# EasyEDA Pro project ProPrj_FLAVRTOWN BADGE_2026-02-28.epro, schematic Schematic1
Board Name: Board1; Create Date: 2026-02-21; Page Name: P1; Project Name: FLAVRTOWN BADGE; Schematic Name: Schematic1; Update Date: 2026-02-23; Company: EasyEDA.com; Page Size: A4; Version: V1.0
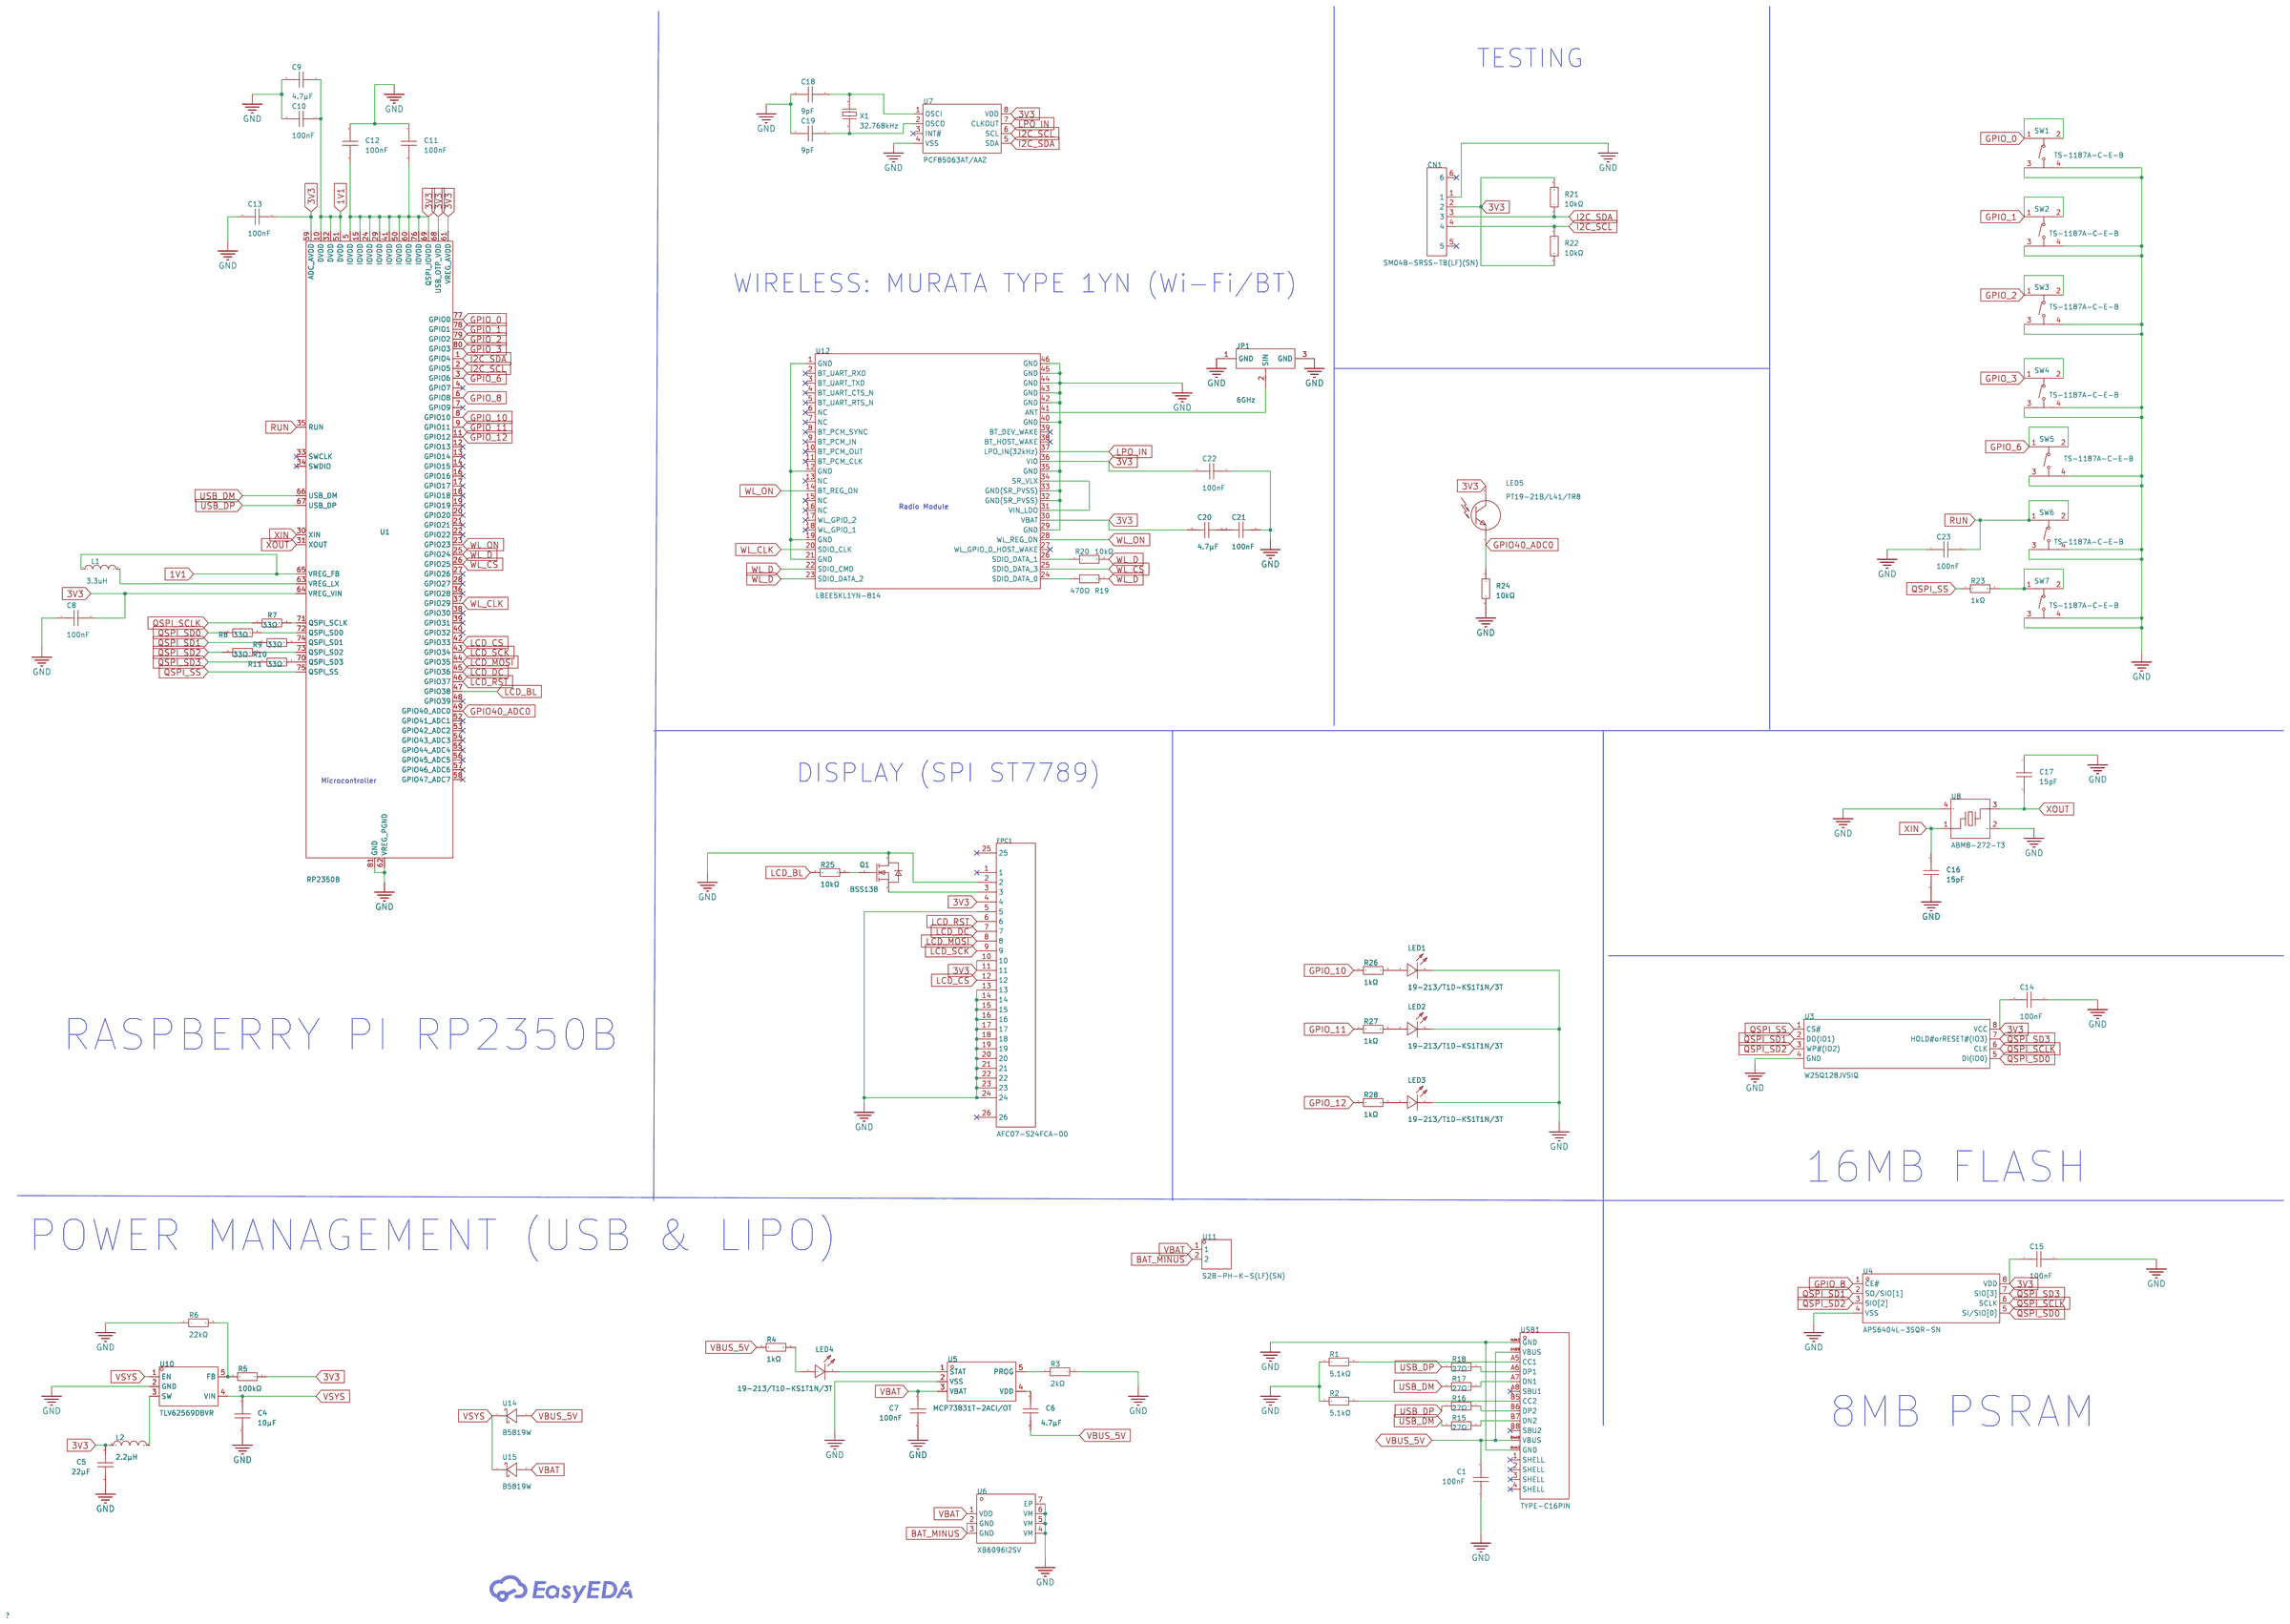
[diagram p0: schematic sheet]

## Parts
C1  100nF  [C0805]
C4  10μF  [C0201]
C5  22μF  [C0201]
C6  4.7μF  [C0201]
C7  100nF  [C0201]
C8  100nF  [C0201]
C9  4.7μF  [C0201]
C10  100nF  [C0201]
C11  100nF  [C0201]
C12  100nF  [C0201]
C13  100nF  [C0201]
C14  100nF  [C0201]
C15  100nF  [C0201]
C16  15pF  [C0201]
C17  15pF  [C0201]
C18  9pF  [C0201]
C19  9pF  [C0201]
C20  4.7μF  [C0201]
C21  100nF  [C0201]
C22  100nF  [C0201]
C23  100nF  [C0201]
CN1  SM04B-SRSS-TB(LF)(SN)  [CONN-SMD_4P-P1.00_SM04B-SRSS-TB-LF-SN]
FPC1  AFC07-S24FCA-00  [FPC-SMD_AFC07-S24FCA-00]
JP1  6GHz  [ANT-SMD_UFL-R-SMT-1-10]
L1  3.3uH  [IND-SMD_L2.0-W1.6_AOTA-B201610S3R3-101-T]
L2  2.2μH  [L0402]
LED1  19-213/T1D-KS1T1N/3T  [LED0603-R-RD]
LED2  19-213/T1D-KS1T1N/3T  [LED0603-R-RD]
LED3  19-213/T1D-KS1T1N/3T  [LED0603-R-RD]
LED4  19-213/T1D-KS1T1N/3T  [LED0603-R-RD]
LED5  PT19-21B/L41/TR8  [SENSOR-TH_PT19-21B-L41-TR8]
Q1  BSS138  [SOT-23-3_L3.0-W1.7-P0.95-LS2.9-BR]
R1  5.1kΩ  [R0603]
R2  5.1kΩ  [R0603]
R3  2kΩ  [R0603]
R4  1kΩ  [R0603]
R5  100kΩ  [R0603]
R6  22kΩ  [R0603]
R7  33Ω  [R0603]
R8  33Ω  [R0603]
R9  33Ω  [R0603]
R10  33Ω  [R0603]
R11  33Ω  [R0603]
R15  27Ω  [R0603]
R16  27Ω  [R0603]
R17  27Ω  [R0603]
R18  27Ω  [R0603]
R19  470Ω  [R0603]
R20  10kΩ  [R0603]
R21  10kΩ  [R0603]
R22  10kΩ  [R0603]
R23  1kΩ  [R0603]
R24  10kΩ  [R0603]
R25  10kΩ  [R0603]
R26  1kΩ  [R0603]
R27  1kΩ  [R0603]
R28  1kΩ  [R0603]
SW1  TS-1187A-C-E-B  [SW-SMD_4P-L5.1-W5.1-P3.70-LS6.5-TL_H2.5]
SW2  TS-1187A-C-E-B  [SW-SMD_4P-L5.1-W5.1-P3.70-LS6.5-TL_H2.5]
SW3  TS-1187A-C-E-B  [SW-SMD_4P-L5.1-W5.1-P3.70-LS6.5-TL_H2.5]
SW4  TS-1187A-C-E-B  [SW-SMD_4P-L5.1-W5.1-P3.70-LS6.5-TL_H2.5]
SW5  TS-1187A-C-E-B  [SW-SMD_4P-L5.1-W5.1-P3.70-LS6.5-TL_H2.5]
SW6  TS-1187A-C-E-B  [SW-SMD_4P-L5.1-W5.1-P3.70-LS6.5-TL_H2.5]
SW7  TS-1187A-C-E-B  [SW-SMD_4P-L5.1-W5.1-P3.70-LS6.5-TL_H2.5]
U1  RP2350B  [QFN-80_L10.0-W10.0-P0.40-TL-EP3.4]
U3  W25Q128JVSIQ  [SOIC-8_L5.3-W5.3-P1.27-LS8.0-BL]
U4  APS6404L-3SQR-SN  [SOIC-8_L4.9-W3.9-P1.27-LS6.0-BL]
U5  MCP73831T-2ACI/OT  [SOT-23-5_L3.0-W1.7-P0.95-LS2.8-BL]
U6  XB6096I2SV  [WDFN-6_L2.0-W2.0-P0.65-BL-EP]
U7  PCF85063AT/AAZ  [SO-8_L4.9-W3.9-P1.27-LS5.9-BL]
U8  ABM8-272-T3  [CRYSTAL-SMD_4P-L3.2-W2.5-BL]
U10  TLV62569DBVR  [SOT-23-5_L3.0-W1.7-P0.95-LS2.8-BR]
U11  S2B-PH-K-S(LF)(SN)  [CONN-TH_S2B-PH-K-S-LF-SN]
U12  LBEE5KL1YN-814  [LGA-46_L7.0-W5.2_LBEE5KL1DX-883]
U14  B5819W  [SOD-123_L2.7-W1.8-LS3.7-RD]
U15  B5819W  [SOD-123_L2.7-W1.8-LS3.7-RD]
USB1  TYPE-C16PIN  [USB-C-SMD_TYPE-C16PIN]
X1  32.768kHz  [CRYSTAL-SMD_L3.2-W1.5-1]

## Library data of the parts
C1 = CAP_0805: Supplier Footprint: 0805
C4-C23 = CAP_0201: Supplier Footprint: 0201
CN1 = SM04B-SRSS-TB(LF)(SN): Pins Structure:1x4P Pitch:1mm Mounting Type:Surface Mount, Right Angle Reference Series:SH Number of Pins:4P Number of Rows:1 Number of PINs Per Row:4 Row Spacing:- Current Rating:1A Contact Material:Copper Alloy Contact Plating:Tin Operating Temperature:; LCSC Part Name: 1x4P 间距:1mm 卧贴 系列:SH; Supplier Part: C160404; Manufacturer: JST; Supplier Footprint: SMD,P=1mm,卧贴; JLCPCB Part Class: Extended Part; Datasheet: https://item.szlcsc.com/datasheet/SM04B-SRSS-TB(LF)(SN)/171784.html; Supplier: LCSC; Pins Structure: 1x4P; Pitch: 1mm; Mounting Type: Surface Mount, Right Angle; Reference Series: SH; Number of Pins: 4P; Number of Rows: 1; Number of PINs Per Row: 4; Current Rating: 1A; Contact Material: Copper Alloy; Contact Plating: Tin; Operating Temperature: -25℃~+85℃; Voltage Rating: 50V; Plastic Material: PA; Flame Retardant Rating: UL94V-0; Supplementary Features: Auxiliary Solder Pin; Color: White; Z-Height of the Board: 2.9mm; X-Length of Bottom Edge on Board (Spacing Line): 6mm; Y-Width of Bottom Edge on Board: 4.32mm
FPC1 = AFC07-S24FCA-00: Locking Feature:Slide Lock Contact Type:Bottom Contact Number of Contacts:24P Pitch:0.5mm Mounting Type:Surface Mount, Right Angle FFC, FCB Thickness:0.3mm FFC, FCB Thickness:0.3mm Height Above Board:2mm Contact Material:Copper Alloy Contact Plating:Tin; LCSC Part Name: 抽屉式 下接 P数:24P 间距:0.5mm; Supplier Part: C262567; Manufacturer: JS(钜硕电子); Supplier Footprint: SMD,P=0.5mm,卧贴; JLCPCB Part Class: Extended Part; Datasheet: https://item.szlcsc.com/datasheet/AFC07-S24FCA-00/253876.html; Supplier: LCSC; Locking Feature: Slide Lock; Contact Type: Bottom Contact; Number of Contacts: 24P; Pitch: 0.5mm; Mounting Type: Surface Mount, Right Angle; FFC, FCB Thickness: 0.3mm; Height Above Board: 2mm; Contact Material: Copper Alloy; Contact Plating: Tin
JP1 = U.FL-R-SMT-1(10): Connector Type:Board Side Interface:Male Pin Number of Ports:1 Interface Diameter:2mm Interface Length/Height:1.25mm Frequency:6GHz RF Series:IPEX Impedance:50Ω Style:- Operating Temperature Range:-40℃~+90℃ Operating Temperature Range:-40℃~+90℃; LCSC Part Name: IPEX 内针; Supplier Part: C88373; Manufacturer: HRS(广濑); Supplier Footprint: SMD; JLCPCB Part Class: Extended Part; Datasheet: https://item.szlcsc.com/datasheet/U.FL-R-SMT-1(10)/89552.html; Supplier: LCSC; Connector Type: Board Side; Interface: Male Pin; Number of Ports: 1; Interface Diameter: 2mm; Interface Length/Height: 1.25mm; RF Series: IPEX; Impedance: 50Ω; Operating Temperature Range: -40℃~+90℃
L1 = AOTA-B201610S3R3-101-T: Inductance:3.3uH Current Rating:2.1A Current - Saturation(Isat):2.4A DC Resistance(DCR):115mΩ Type:Molded Inductor; LCSC Part Name: 3.3uH 2.4A; Supplier Part: C42411119; Manufacturer: ABRACON; Supplier Footprint: 0806; JLCPCB Part Class: Extended Part; Datasheet: https://item.szlcsc.com/datasheet/AOTA-B201610S3R3-101-T/44392932.html; Supplier: LCSC; Current Rating: 2.1A; Current - Saturation(Isat): 2.4A; DC Resistance(DCR): 115mΩ; Type: Molded Inductor
L2 = L_0402
LED1-LED4 = 19-213/T1D-KS1T1N/3T: Illumination Color:White; LCSC Part Name: 停产 白灯; Supplier Part: C183845; Manufacturer: EVERLIGHT(亿光); Supplier Footprint: 0603; JLCPCB Part Class: Extended Part; Datasheet: https://en.everlight.com/wp-content/plugins/ItemRelationship/product_files/pdf/19-213-T1D-KS1T1N-3T.pdf; Supplier: LCSC; Illumination Color: White
LED5 = PT19-21B/L41/TR8: type:NPN Collector - Emitter Voltage VCEO:30V Collector - Emitter Voltage VCEO:30V Current - Collector(Ic):20mA Dissipation Power(Max):75mW Current - Dark(Id):100nA Peak Wavelength:940nm Viewing Angle:- Operating Temperature:-25℃~+85℃ Operating Temperatur; LCSC Part Name: 940nm的NPN光电三极管; Supplier Part: C131258; Manufacturer: EVERLIGHT(亿光); Supplier Footprint: 0603; JLCPCB Part Class: Extended Part; Datasheet: https://www.everlight.com.cn/wp-content/plugins/ItemRelationship/product_files/pdf/DPT-0000302-PT19-21B-L41-TR8_Datasheet_Rev6.pdf; Supplier: LCSC; type: NPN; Collector - Emitter Voltage VCEO: 30V; Current - Collector(Ic): 20mA; Dissipation Power(Max): 75mW; Current - Dark(Id): 100nA; Peak Wavelength: 940nm; Operating Temperature: -25℃~+85℃; Vce Saturation(VCE(sat)): 0.4V@2mA
Q1 = BSS138_C53058666: Supplier Part: C53058666; Manufacturer: luJing(鲁晶); Supplier Footprint: SOT-23; JLCPCB Part Class: Extended Part; Datasheet: https://item.szlcsc.com/datasheet/BSS138/56008455.html; Supplier: LCSC
R1-R11 R15-R28 = Res_0603: Supplier Footprint: 0603
SW1-SW7 = TS-1187A-C-E-B: Circuit:SPST Actuator Style:Round Button Operating Force:2.6N Mounting Type:Surface Mount,Vertical Length:5.1mm Width:5.1mm Switch Height:2.5mm with Bracket:Without Bracket Contact Current:50mA Voltage Rating:12V Actuator/Cap Color:Gold With Lamp:No IP Ra; LCSC Part Name: 5.1*5.1*2.5mm 立贴 轻触开关; Supplier Part: C318887; Manufacturer: XKB Connection(中国星坤); Supplier Footprint: SMD; JLCPCB Part Class: Extended Part; Datasheet: https://item.szlcsc.com/datasheet/TS-1187A-C-E-B/299979.html; Supplier: LCSC; Circuit: SPST; Actuator Style: Round Button; Operating Force: 2.6N; Mounting Type: Surface Mount,Vertical; Length: 5.1mm; Width: 5.1mm; Switch Height: 2.5mm; with Bracket: Without Bracket; Contact Current: 50mA; Voltage Rating: 12V; Actuator/Cap Color: Gold; With Lamp: No; Life: 100,000 Cycles; Operating Temperature: -30℃~+85℃
U1 = RP2350B_C42415655: LCSC Part Name: 微控制器; Supplier Part: C42415655; Manufacturer: Raspberry Pi(树莓派); Supplier Footprint: QFN-80-EP(10x10); JLCPCB Part Class: Extended Part; Datasheet: https://item.szlcsc.com/datasheet/RP2350B/44413055.html; Supplier: LCSC
U3 = W25Q128JVSIQ_C113767: Interface:SPI Memory Size:- Clock Frequency:133MHz Voltage - Supply:2.7V~3.6V Voltage - Supply:2.7V~3.6V Program / Erase Cycles:100,000 Cycles Page Programming Time (Tpp):3ms Operating Temperature:- Operating Temperature:-; LCSC Part Name: 支持双路/四路SPI接口的3V、128Mbit 串行闪存; Supplier Part: C113767; Manufacturer: Winbond(华邦); Supplier Footprint: SOIC-8-208mil; JLCPCB Part Class: Extended Part; Datasheet: https://item.szlcsc.com/datasheet/W25Q128JVSIQ/115003.html; Supplier: LCSC; Interface: SPI; Clock Frequency: 133MHz; Voltage - Supply: 2.7V~3.6V; Program / Erase Cycles: 100,000 Cycles; Page Programming Time (Tpp): 3ms
U4 = APS6404L-3SQR-SN_C5333729: Supplier Part: C5333729; Manufacturer: Apmemory; Supplier Footprint: SOP-8; JLCPCB Part Class: Extended Part; Supplier: LCSC
U5 = MCP73831T-2ACI/OT: The Chip Type:Charging IC Voltage - Supply:3.75V~6V Voltage - Supply:3.75V~6V Charge Current - Max:550mA Charging Saturation Voltage:4.2V Type of Battery:Lithium Battery Number of Cells:1 Number of Cells:1 Operating Temperature:-40℃~+85℃ Operating Tempera; LCSC Part Name: 单节锂离子/锂聚合物充电管理控制器; Supplier Part: C424093; Manufacturer: MICROCHIP(美国微芯); Supplier Footprint: SOT-23-5; JLCPCB Part Class: Extended Part; Datasheet: https://item.szlcsc.com/datasheet/MCP73831T-2ACI%252FOT/417116.html; Supplier: LCSC; The Chip Type: Charging IC; Voltage - Supply: 3.75V~6V; Charge Current - Max: 550mA; Charging Saturation Voltage: 4.2V; Type of Battery: Lithium Battery; Number of Cells: 1; Operating Temperature: -40℃~+85℃; Supply Current (Iq): 53uA
U6 = XB6096I2SV: The Chip Type:- Voltage - Supply:3.6V~6V Voltage - Supply:3.6V~6V Charging Saturation Voltage:4.3V End-Off Voltage:2.8V Type of Battery:Lithium Battery Number of Cells:1 Number of Cells:1 Operating Temperature:-40℃~+85℃ Operating Temperature:-40℃~+85℃ 0V; LCSC Part Name: 停产 One Cell Lithium-ion/Polymer Battery Protection IC 停产; Supplier Part: C2998744; Manufacturer: xysemi(赛芯微); Supplier Footprint: DFN-6(2x2); JLCPCB Part Class: Extended Part; Datasheet: https://item.szlcsc.com/datasheet/XB6096I2SV/3473618.html; Supplier: LCSC; Voltage - Supply: 3.6V~6V; Charging Saturation Voltage: 4.3V; End-Off Voltage: 2.8V; Type of Battery: Lithium Battery; Number of Cells: 1; Operating Temperature: -40℃~+85℃; 0V Battery Charge: Support; Supply Current (Iq): 100nA
U7 = PCF85063AT/AAZ: Interface:I2C Voltage - Supply:900mV~5.5V Voltage - Supply:900mV~5.5V Current - Supply:220nA crystal oscillator:Built-In Alarm Output:Yes Operating Temperature:-40℃~+85℃ Operating Temperature:-40℃~+85℃; LCSC Part Name: 微型实时时钟/日历，带报警功能和I²C总线; Supplier Part: C2157792; Manufacturer: NXP(恩智浦); Supplier Footprint: SO-8; JLCPCB Part Class: Extended Part; Datasheet: https://www.nxp.com.cn/docs/en/data-sheet/PCF85063A.pdf; Supplier: LCSC; Interface: I2C; Voltage - Supply: 900mV~5.5V; Current - Supply: 220nA; crystal oscillator: Built-In; Alarm Output: Yes; Operating Temperature: -40℃~+85℃
U8 = ABM8-272-T3_C20625731: Supplier Part: C20625731; Manufacturer: ABRACON; Supplier Footprint: SMD3225-4P; JLCPCB Part Class: Extended Part; Datasheet: https://item.szlcsc.com/datasheet/ABM8-272-T3/22032038.html; Supplier: LCSC
U10 = TLV62569DBVR: Function:Buck Voltage - Supply:2.5V~5.5V Voltage - Supply:2.5V~5.5V Output Voltage:600mV~5.5V Output Voltage:600mV~5.5V Output Current:2A Frequency - Switching:1.5MHz Frequency - Switching:1.5MHz Operating Temperature:-40℃~+125℃@(TJ) Operating Temperature; LCSC Part Name: 高效率同步降压转换器; Supplier Part: C141836; Manufacturer: TI(德州仪器); Supplier Footprint: SOT-23-5; JLCPCB Part Class: Extended Part; Datasheet: https://www.ti.com/cn/lit/gpn/tlv62569; Supplier: LCSC; Function: Buck; Voltage - Supply: 2.5V~5.5V; Output Voltage: 600mV~5.5V; Output Current: 2A; Frequency - Switching: 1.5MHz; Operating Temperature: -40℃~+125℃@(TJ); Synchronous Rectifier: Yes; Number of Outputs: 1; Topology: Buck; Switch tube (built-in/external): Built-in; Output Type: Adjustable
U11 = S2B-PH-K-S(LF)(SN): Pins Structure:1x2P Pitch:2mm Mounting Type:Right Angle Reference Series:PH Number of Pins:2P Number of Rows:1 Number of PINs Per Row:2 Row Spacing:- Current Rating:2A Contact Material:Brass Contact Plating:Tin Operating Temperature:-25℃~+85℃ Operating Te; LCSC Part Name: 1x2P 间距:2mm 弯插 系列:PH; Supplier Part: C173752; Manufacturer: JST; Supplier Footprint: 弯插,P=2mm; JLCPCB Part Class: Extended Part; Datasheet: https://item.szlcsc.com/datasheet/S2B-PH-K-S(LF)(SN)/185142.html; Supplier: LCSC; Pins Structure: 1x2P; Pitch: 2mm; Mounting Type: Right Angle; Reference Series: PH; Number of Pins: 2P; Number of Rows: 1; Number of PINs Per Row: 2; Current Rating: 2A; Contact Material: Brass; Contact Plating: Tin; Operating Temperature: -25℃~+85℃; Voltage Rating: 100V; Plastic Material: PA66; Flame Retardant Rating: UL94V-0; Supplementary Features: K Pin; Color: White; Z-Height of the Board: 4.8mm; X-Length of Bottom Edge on Board (Spacing Line): 5.9mm; Y-Width of Bottom Edge on Board: 7.6mm
U12 = LBEE5KL1YN-814: Supplier Part: C6583742; Manufacturer: muRata(村田); Supplier Footprint: SMD-46P; JLCPCB Part Class: Extended Part; Datasheet: https://item.szlcsc.com/datasheet/LBEE5KL1YN-814/7538542.html; Supplier: LCSC
U14 U15 = B5819W_C2843323: Diode Configuration:Independent Voltage - Forward(Vf@If):900mV@3A Voltage - DC Reverse(Vr):40V Current - Rectified:1A Reverse Leakage Current (Ir):1mA@40V Operating Junction Temperature Range:-55℃~+125℃ Operating Junction Temperature Range:-55℃~+125℃ Non-; LCSC Part Name: 电压:40V 电流:1A; Supplier Part: C2843323; Manufacturer: Slkor(萨科微); Supplier Footprint: SOD-123; JLCPCB Part Class: Extended Part; Datasheet: https://item.szlcsc.com/datasheet/B5819W/3030279.html; Supplier: LCSC; Diode Configuration: Independent; Voltage - Forward(Vf@If): 900mV@3A; Voltage - DC Reverse(Vr): 40V; Current - Rectified: 1A; Reverse Leakage Current (Ir): 1mA@40V; Operating Junction Temperature Range: -55℃~+125℃; Non-Repetitive Peak Forward Surge Current: 25A
USB1 = TYPE-C16PIN: Connector Type:Type-C Protocol Standard:- Gender:Female Mounting Type:Surface Mount, Right Angle Number of Contacts:16P Number of Ports:1 Current Rating-Power:3A Voltage Rating:30V Connect-Disconnect Life:10,000 Cycles Supplementary Features:- Center Heig; LCSC Part Name: 16P卧贴母座; Supplier Part: C393939; Manufacturer: SHOU HAN(首韩); Supplier Footprint: SMD; JLCPCB Part Class: Extended Part; Datasheet: https://item.szlcsc.com/datasheet/TYPE-C16PIN/372551.html; Supplier: LCSC; Connector Type: Type-C; Gender: Female; Mounting Type: Surface Mount, Right Angle; Number of Contacts: 16P; Number of Ports: 1; Current Rating-Power: 3A; Voltage Rating: 30V; Connect-Disconnect Life: 10,000 Cycles; Detection color: Black; Operating Temperature: -40℃~+85℃
X1 = FC-135R 32.7680KA-A3: Frequency:32.768kHz Normal temperature Frequency Tolerance:±20ppm Normal temperature Frequency Tolerance:±20ppm Load Capacitance:12.5pF Equivalent Series Resistance(ESR):50kΩ Operating Temperature:-40℃~+85℃ Operating Temperature:-40℃~+85℃; LCSC Part Name: 32.768kHz ±20ppm 12.5pF; Supplier Part: C6554955; Manufacturer: EPSON(爱普生); Supplier Footprint: SMD3215-2P; JLCPCB Part Class: Extended Part; Datasheet: https://item.szlcsc.com/datasheet/FC-135R%252032.7680KA-A3/7508731.html; Supplier: LCSC; Normal temperature Frequency Tolerance: ±20ppm; Load Capacitance: 12.5pF; Equivalent Series Resistance(ESR): 50kΩ; Operating Temperature: -40℃~+85℃

## Nets
1V1: C9.1 C10.1 L1.1 U1.10(DVDD) U1.32(DVDD) U1.51(DVDD) U1.65(VREG_FB)
3V3: C5.2 C8.2 C11.2 C12.2 C13.1 C14.2 C15.2 C20.2 C22.2 CN1.2 FPC1.4 FPC1.10 FPC1.11 L2.1 LED5.2(C) R5.2 R21.2 R22.2 U1.5(IOVDD) U1.15(IOVDD) U1.24(IOVDD) U1.29(IOVDD) U1.41(IOVDD) U1.50(IOVDD) U1.59(ADC_AVDD) U1.60(IOVDD) U1.61(VREG_AVDD) U1.64(VREG_VIN) U1.68(USB_OTP_VDD) U1.69(QSPI_IOVDD) U1.76(IOVDD) U3.8(VCC) U4.8(VDD) U7.8(VDD) U12.30(VBAT) U12.36(VIO)
GND: C1.1 C4.2 C5.1 C7.2 C8.1 C9.2 C10.2 C11.1 C12.1 C13.2 C14.1 C15.1 C16.2 C17.1 C18.2 C19.2 C21.1 C22.1 C23.2 CN1.1 FPC1.2 FPC1.5 FPC1.13 FPC1.14 FPC1.15 FPC1.16 FPC1.17 FPC1.18 FPC1.19 FPC1.20 FPC1.21 FPC1.22 FPC1.23 FPC1.24 JP1.1(GND) JP1.3(GND) LED1.2(C) LED2.2(C) LED3.2(C) Q1.3(D) R1.1 R2.1 R3.2 R6.1 R24.2 SW1.3(C) SW1.4(D) SW2.3(C) SW2.4(D) SW3.3(C) SW3.4(D) SW4.3(C) SW4.4(D) SW5.3(C) SW5.4(D) SW6.3(C) SW6.4(D) SW7.3(C) SW7.4(D) U1.62(VREG_PGND) U1.81(GND) U3.4(GND) U4.4(VSS) U5.2(VSS) U6.4(VM) U6.5(VM) U6.6(VM) U6.7(EP) U7.4(VSS) U8.2(GND) U8.4(GND) U10.2(GND) U12.29(GND) U12.32(GND(SR_PVSS)) U12.33(GND(SR_PVSS)) U12.35(GND) U12.40(GND) U12.42(GND) U12.43(GND) U12.44(GND) U12.45(GND) U12.46(GND) USB1.A1B12(GND) USB1.B1A12(GND)
VBAT: C7.1 U5.3(VBAT) U6.1(VDD) U11.1 U15.2(A)
VBUS_5V: C1.2 C6.2 R4.1 U14.2(A) USB1.A4B9(VBUS) USB1.B4A9(VBUS)
BAT_MINUS: U6.2(GND) U6.3(GND) U11.2
GPIO40_ADC0: LED5.1(E) R24.1 U1.49(GPIO40_ADC0)
GPIO_0: SW1.1(A) SW1.2(B) U1.77(GPIO0)
GPIO_1: SW2.1(A) SW2.2(B) U1.78(GPIO1)
GPIO_2: SW3.1(A) SW3.2(B) U1.79(GPIO2)
GPIO_3: SW4.1(A) SW4.2(B) U1.80(GPIO3)
GPIO_6: SW5.1(A) SW5.2(B) U1.3(GPIO6)
GPIO_8: U1.6(GPIO8) U4.1(CE#)
GPIO_10: R26.1 U1.8(GPIO10)
GPIO_11: R27.1 U1.9(GPIO11)
GPIO_12: R28.1 U1.11(GPIO12)
I2C_SCL: CN1.4 R22.1 U1.2(GPIO5) U7.6(SCL)
I2C_SDA: CN1.3 R21.1 U1.1(GPIO4) U7.5(SDA)
LCD_BL: Q1.1(G) R25.1 R25.2 U1.47(GPIO38)
LCD_CS: FPC1.12 U1.42(GPIO33)
LCD_DC: FPC1.7 U1.45(GPIO36)
LCD_MOSI: FPC1.8 U1.44(GPIO35)
LCD_RST: FPC1.6 U1.46(GPIO37)
LCD_SCK: FPC1.9 U1.43(GPIO34)
LPO_IN: U7.7(CLKOUT) U12.37(LPO_IN(32kHz))
QSPI_SCLK: R7.1 U3.6(CLK) U4.6(SCLK)
QSPI_SD0: R8.1 U3.5(DI(IO0)) U4.5(SI/SIO[0])
QSPI_SD1: R9.1 U3.2(DO(IO1)) U4.2(SO/SIO[1])
QSPI_SD2: R10.1 U3.3(WP#(IO2)) U4.3(SIO[2])
QSPI_SD3: R11.1 U3.7(HOLD#orRESET#(IO3)) U4.7(SIO[3])
QSPI_SS: R23.1 U1.75(QSPI_SS) U3.1(CS#)
RUN: C23.1 SW6.1(A) SW6.2(B) U1.35(RUN)
USB_DM: R15.1 R15.2 R17.1 R17.2 U1.66(USB_DM) USB1.A7(DN1) USB1.B7(DN2)
USB_DP: R16.1 R16.2 R18.1 R18.2 U1.67(USB_DP) USB1.A6(DP1) USB1.B6(DP2)
VSYS: C4.1 U10.1(EN) U10.4(VIN) U14.1(C) U15.1(C)
WL_CLK: U1.37(GPIO29) U12.20(SDIO_CLK)
WL_CS: U1.26(GPIO25) U12.25(SDIO_DATA_3)
WL_D: R19.2 R20.2 U1.25(GPIO24) U12.22(SDIO_CMD) U12.23(SDIO_DATA_2)
WL_ON: U1.23(GPIO23) U12.14(BT_REG_ON) U12.28(WL_REG_ON)
XIN: C16.1 U1.30(XIN) U8.1
XOUT: C17.2 U1.31(XOUT) U8.3
$1N4978: R1.2 USB1.A5(CC1)
$1N4982: R2.2 USB1.B5(CC2)
$1N5126: C6.1 U5.4(VDD)
$1N5202: R3.1 U5.5(PROG)
$1N5235: LED4.2(C) U5.1(STAT)
$1N5247: LED4.1(A) R4.2
$1N8083: R5.1 R6.2 U10.5(FB)
$1N8205: L2.2 U10.3(SW)
$1N8633: L1.2 U1.63(VREG_LX)
$1N9372: R7.2 U1.71(QSPI_SCLK)
$1N9469: R8.2 U1.72(QSPI_SD0)
$1N9502: R9.2 U1.74(QSPI_SD1)
$1N9530: R10.2 U1.73(QSPI_SD2)
$1N9625: R11.2 U1.70(QSPI_SD3)
$1N13630: R19.1 U12.24(SDIO_DATA_0)
$1N13750: R20.1 U12.26(SDIO_DATA_1)
$1N13874: C18.1 U7.1(OSCI) X1.2(GND)
$1N13880: C19.1 U7.2(OSCO) X1.1
$1N14224: C20.1 C21.2
$1N14355: U12.1(GND) U12.12(GND) U12.19(GND) U12.21(GND)
$1N14602: U12.31(VIN_LDO) U12.34(SR_VLX)
$1N15410: FPC1.3 Q1.2(S)
$1N16712: R23.2 SW7.1(A) SW7.2(B)
$1N16990: LED1.1(A) R26.2
$1N17040: LED3.1(A) R28.2
$1N17066: LED2.1(A) R27.2
$1N21767: JP1.2(SIN) U12.41(ANT)

Not connected (* = marked no-connect by the designer): CN1 5* 6*; FPC1 1* 25* 26*; U1 4(GPIO7)* 7(GPIO9)* 12(GPIO13)* 13(GPIO14)* 14(GPIO15)* 16(GPIO16)* 17(GPIO17)* 18(GPIO18)* 19(GPIO19)* 20(GPIO20)* 21(GPIO21)* 22(GPIO22)* 27(GPIO26)* 28(GPIO27)* 33(SWCLK)* 34(SWDIO)* 36(GPIO28)* 38(GPIO30)* 39(GPIO31)* 40(GPIO32)* 48(GPIO39)* 52(GPIO41_ADC1)* 53(GPIO42_ADC2)* 54(GPIO43_ADC3)* 55(GPIO44_ADC4)* 56(GPIO45_ADC5)* 57(GPIO46_ADC6)* 58(GPIO47_ADC7)*; U7 3(INT#)*; U12 2(BT_UART_RXD)* 3(BT_UART_TXD)* 4(BT_UART_CTS_N)* 5(BT_UART_RTS_N)* 6(NC)* 7(NC)* 8(BT_PCM_SYNC)* 9(BT_PCM_IN)* 10(BT_PCM_OUT)* 11(BT_PCM_CLK)* 13(NC)* 15(NC)* 16(NC)* 17(WL_GPIO_2)* 18(WL_GPIO_1)* 27(WL_GPIO_0_HOST_WAKE)* 38(BT_HOST_WAKE)* 39(BT_DEV_WAKE)*; USB1 1(SHELL)* 2(SHELL)* 3(SHELL)* 4(SHELL)* A8(SBU1)* B8(SBU2)*

## Notes on the sheet
- TESTING
- WIRELESS: MURATA TYPE 1YN (Wi-Fi/BT)
- Radio Module
- Microcontroller
- DISPLAY (SPI ST7789)
- RASPBERRY PI RP2350B
- 16MB FLASH
- POWER MANAGEMENT (USB & LIPO)
- 8MB PSRAM
